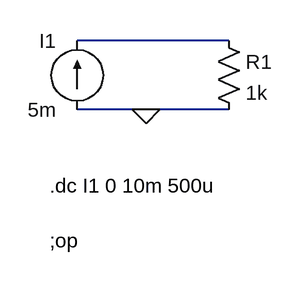
[diagram p0: schematic 1d.asc]
1d.asc, the LTspice schematic file:
Version 4
SHEET 1 880 680
WIRE 240 80 64 80
WIRE 144 160 64 160
WIRE 240 160 144 160
FLAG 144 160 0
SYMBOL current 64 160 R180
WINDOW 0 24 80 Left 2
WINDOW 3 24 0 Left 2
WINDOW 123 0 0 Left 0
WINDOW 39 0 0 Left 0
SYMATTR InstName I1
SYMATTR Value 5m
SYMBOL res 224 64 R0
SYMATTR InstName R1
SYMATTR Value 1k
TEXT 32 248 Left 2 !.dc I1 0 10m 500u
TEXT 32 312 Left 2 !;op

The netlist it stands for:
* 1d.asc
I1 0 N001 5m
R1 N001 0 1k
.dc I1 0 10m 500u
;op
.backanno
.end